# EAGLE design variable_supply_module_v3 (EAGLE 7.1.0)
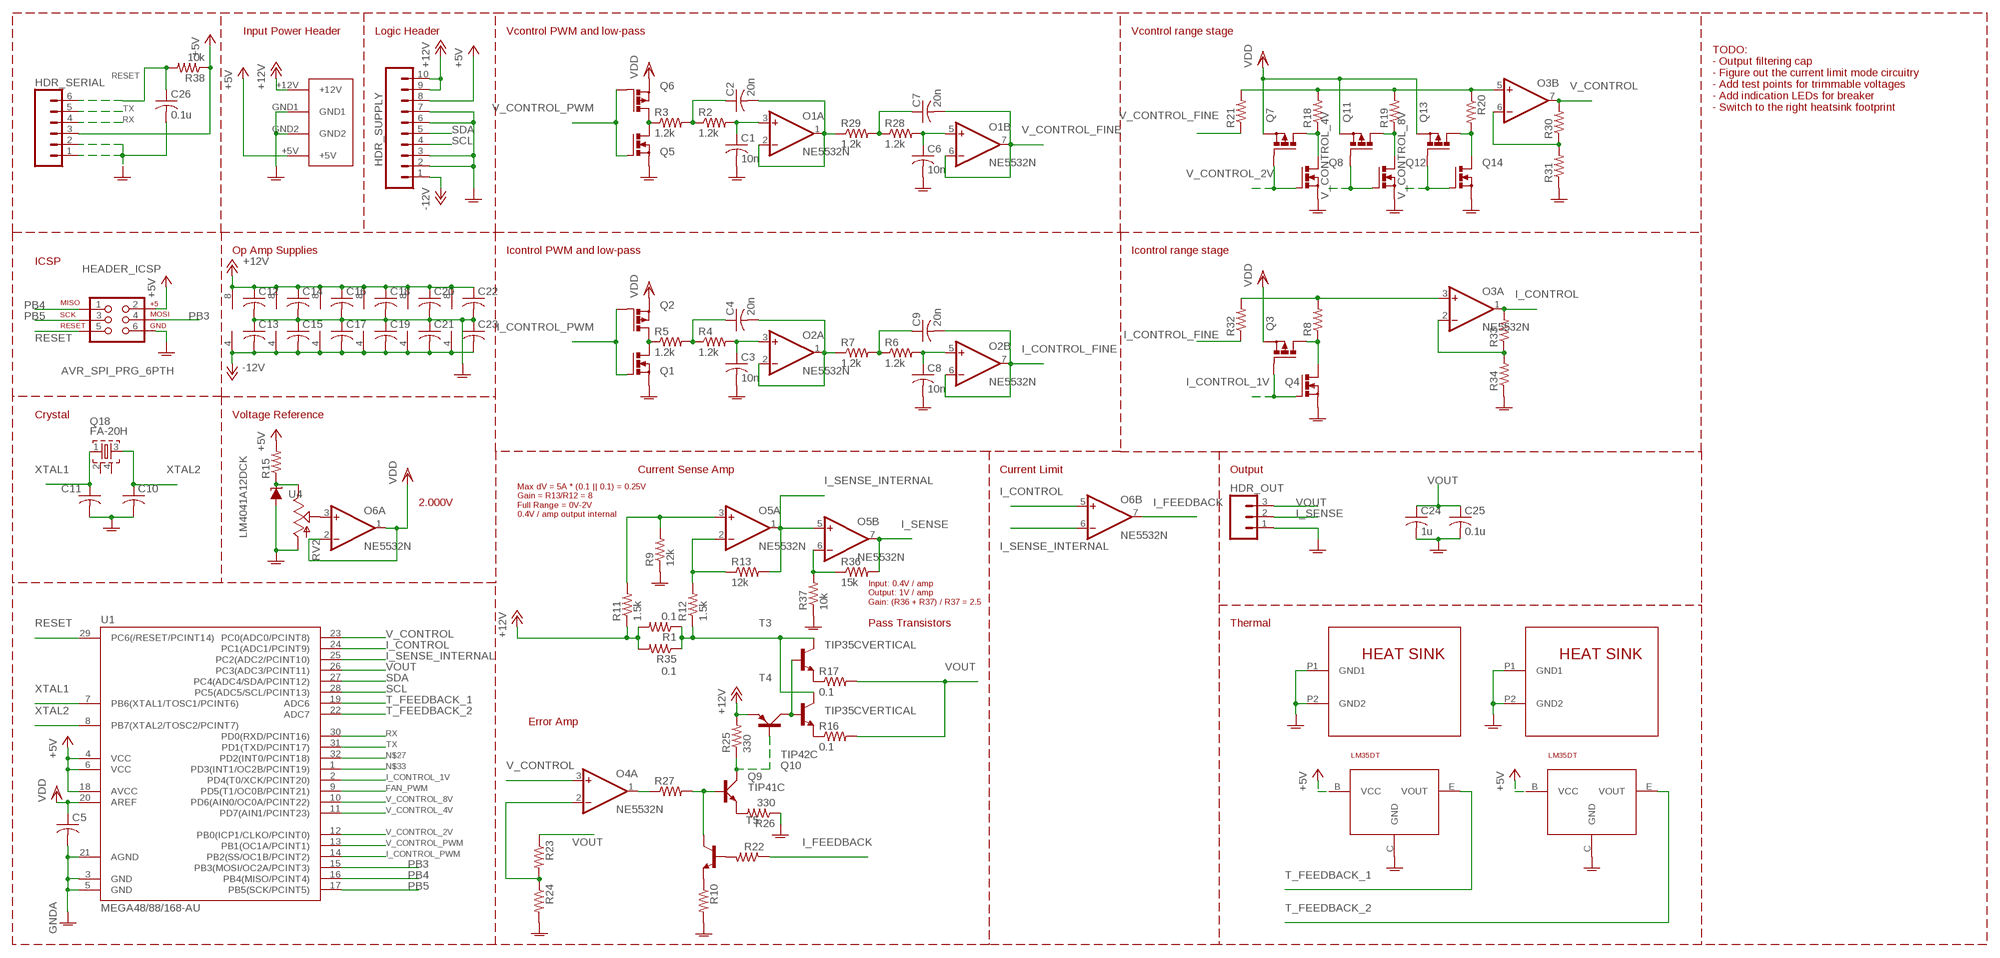
[diagram p0: schematic, sheet 1]

## Parts
C1  10n  C-USC0805  [C0805]
C2  20n  C-USC0805  [C0805]
C3  10n  C-USC0805  [C0805]
C4  20n  C-USC0805  [C0805]
C5  C-USC0805  [C0805]
C6  10n  C-USC0805  [C0805]
C7  20n  C-USC0805  [C0805]
C8  10n  C-USC0805  [C0805]
C9  20n  C-USC0805  [C0805]
C10  C-USC0805  [C0805]
C11  C-USC0805  [C0805]
C12  C-USC0805  [C0805]
C13  C-USC0805  [C0805]
C14  C-USC0805  [C0805]
C15  C-USC0805  [C0805]
C16  C-USC0805  [C0805]
C17  C-USC0805  [C0805]
C18  C-USC0805  [C0805]
C19  C-USC0805  [C0805]
C20  C-USC0805  [C0805]
C21  C-USC0805  [C0805]
C22  C-USC0805  [C0805]
C23  C-USC0805  [C0805]
C24  1u  C-USC1206  [C1206]
C25  0.1u  C-USC1206  [C1206]
C26  0.1u  C-USC0805  [C0805]
HDR_OUT  M03  [03P]
HDR_SERIAL  M06LONGPADS  [1X06_LONGPADS]
HDR_SUPPLY  M10  [10P]
HEADER_ICSP  AVR_SPI_PRG_6PTH  [2X3]
O1  NE5532N  [DIL08]
O2  NE5532N  [DIL08]
O3  NE5532N  [DIL08]
O4  NE5532N  [DIL08]
O5  NE5532N  [DIL08]
O6  NE5532N  [DIL08]
Q1  PMOSFET_NSOT23-GSD  [SOT23]
Q2  PMOSFET_PSOT-23GSD  [SOT23]
Q3  PMOSFET_PSOT-23GSD  [SOT23]
Q4  PMOSFET_NSOT23-GSD  [SOT23]
Q5  PMOSFET_NSOT23-GSD  [SOT23]
Q6  PMOSFET_PSOT-23GSD  [SOT23]
Q7  PMOSFET_PSOT-23GSD  [SOT23]
Q8  PMOSFET_NSOT23-GSD  [SOT23]
Q9  TIP41C  [TO220AV]
Q10  TIP42C  [TO220AV]
Q11  PMOSFET_PSOT-23GSD  [SOT23]
Q12  PMOSFET_NSOT23-GSD  [SOT23]
Q13  PMOSFET_PSOT-23GSD  [SOT23]
Q14  PMOSFET_NSOT23-GSD  [SOT23]
Q18  FA-20H  [FA-20H]
R1  0.1  R-US_R2010  [R2010]
R2  1.2k  R-US_M0805  [M0805]
R3  1.2k  R-US_M0805  [M0805]
R4  1.2k  R-US_M0805  [M0805]
R5  1.2k  R-US_M0805  [M0805]
R6  1.2k  R-US_M0805  [M0805]
R7  1.2k  R-US_M0805  [M0805]
R8  R-US_M0805  [M0805]
R9  12k  R-US_M0805  [M0805]
R10  R-US_M0805  [M0805]
R11  1.5k  R-US_M0805  [M0805]
R12  1.5k  R-US_M0805  [M0805]
R13  12k  R-US_M0805  [M0805]
R15  R-US_M0805  [M0805]
R16  0.1  R-US_R2010  [R2010]
R17  0.1  R-US_R2010  [R2010]
R18  R-US_M0805  [M0805]
R19  R-US_M0805  [M0805]
R20  R-US_M0805  [M0805]
R21  R-US_M0805  [M0805]
R22  R-US_M0805  [M0805]
R23  R-US_M0805  [M0805]
R24  R-US_M0805  [M0805]
R25  330  R-US_M0805  [M0805]
R26  330  R-US_M0805  [M0805]
R27  R-US_M0805  [M0805]
R28  1.2k  R-US_M0805  [M0805]
R29  1.2k  R-US_M0805  [M0805]
R30  R-US_M0805  [M0805]
R31  R-US_M0805  [M0805]
R32  R-US_M0805  [M0805]
R33  R-US_M0805  [M0805]
R34  R-US_M0805  [M0805]
R35  0.1  R-US_R2010  [R2010]
R36  15k  R-US_M0805  [M0805]
R37  10k  R-US_M0805  [M0805]
R38  10k  R-US_M0805  [M0805]
RV2  POTTRIM  [TRIM_POT]
T3  TIP35CVERTICAL  [TO247]
T4  TIP35CVERTICAL  [TO247]
T5  MMBT2222ALT1-NPN-SOT23-BEC  [SOT23-BEC]
U1  MEGA48/88/168-AU  [TQFP32-08]
U2  LM35DT  [TO220AV]
U3  LM35DT  [TO220AV]
U4  LM4041A12DCK  [DCK_R-PDSO-G5]
U$1  MOLEX-8981  [MOLEX-8981-MALE]
U$2  FA-T220-X  [FA-T220-X]
U$3  FA-T220-X  [FA-T220-X]

## Nets
+5V: HDR_SERIAL.3 HDR_SUPPLY.8 HEADER_ICSP.2 R15.2 R38.1 U1.4(VCC) U1.6(VCC) U1.18(AVCC) U2.B(VCC) U3.B(VCC) U$1.+5V
+12V: C12.1 C14.1 C16.1 C18.1 C20.1 C22.1 HDR_SUPPLY.9 HDR_SUPPLY.10 O1.8(P:V+) O2.8(P:V+) O3.8(P:V+) O4.8(P:V+) O5.8(P:V+) O6.8(P:V+) Q10.E R1.2 R11.1 R25.2 R35.2 U$1.+12V
-12V: C13.2 C15.2 C17.2 C19.2 C21.2 C23.2 HDR_SUPPLY.1 O1.4(P:V-) O2.4(P:V-) O3.4(P:V-) O4.4(P:V-) O5.4(P:V-) O6.4(P:V-)
FAN_PWM: U1.9(PD5(T1/OC0B/PCINT21))
FINE_ADJ: C2.2 O1.1(A:OUT) O1.2(A:-IN) R29.1
FINE_ADJ1: C4.2 O2.1(A:OUT) O2.2(A:-IN) R7.1
GNDA: C1.2 C3.2 C5.2 C6.2 C8.2 C10.2 C11.2 C12.2 C13.1 C14.2 C15.1 C16.2 C17.1 C18.2 C19.1 C20.2 C21.1 C22.2 C23.1 C24.2 C25.2 C26.2 HDR_OUT.1 HDR_SERIAL.1 HDR_SERIAL.2 HDR_SUPPLY.2 HDR_SUPPLY.3 HDR_SUPPLY.6 HDR_SUPPLY.7 HEADER_ICSP.6 Q1.2(S) Q4.2(S) Q5.2(S) Q8.2(S) Q12.2(S) Q14.2(S) R9.1 R10.2 R24.2 R26.1 R31.1 R34.1 R37.1 RV2.3(A) U1.3(GND) U1.5(GND) U1.21(AGND) U2.C(GND) U3.C(GND) U4.1(A) U$1.GND1 U$1.GND2 U$2.P1(GND1) U$2.P2(GND2) U$3.P1(GND1) U$3.P2(GND2)
I_CONTROL: O3.1(A:OUT) O6.5(B:+IN) R33.2 U1.24(PC1(ADC1/PCINT9))
I_CONTROL_1V: Q3.1(G) Q4.1(G) U1.2(PD4(T0/XCK/PCINT20))
I_CONTROL_FINE: C9.2 O2.6(B:-IN) O2.7(B:OUT) R32.1
I_CONTROL_PWM: Q1.1(G) Q2.1(G) U1.14(PB2(SS/OC1B/PCINT2))
I_FEEDBACK: O6.7(B:OUT) R22.1
I_SENSE: HDR_OUT.2 O5.7(B:OUT) R36.2
I_SENSE_INTERNAL: O5.1(A:OUT) O5.5(B:+IN) O6.6(B:-IN) R13.2 U1.25(PC2(ADC2/PCINT10))
N$1: C1.1 O1.3(A:+IN) R2.2
N$2: C2.1 R2.1 R3.2
N$3: C3.1 O2.3(A:+IN) R4.2
N$4: C4.1 R4.1 R5.2
N$5: Q5.3(D) Q6.3(D) R3.1
N$6: Q9.B R27.2 T5.C
N$7: Q1.3(D) Q2.3(D) R5.1
N$8: C8.1 O2.5(B:+IN) R6.2
N$9: C9.1 R6.1 R7.2
N$10: Q13.3(D) Q14.3(D) R20.2
N$11: Q11.3(D) Q12.3(D) R19.1
N$12: Q7.3(D) Q8.3(D) R18.1
N$13: O6.3(A:+IN) RV2.1(S)
N$14: O3.3(A:+IN) R8.2 R32.2
N$15: O5.3(A:+IN) R9.2 R11.2
N$16: O5.2(A:-IN) R12.2 R13.1
N$17: R10.1 T5.E
N$18: R16.1 T4.P3(E)
N$19: R17.1 T3.P3(E)
N$20: R1.1 R12.1 R35.1 T3.P2(C) T4.P2(C)
N$22: O3.2(A:-IN) R33.1 R34.2
N$23: R22.2 T5.B
N$24: O5.6(B:-IN) R36.1 R37.2
N$25: O3.5(B:+IN) R18.2 R19.2 R20.1 R21.2
N$27: U1.32(PD2(INT0/PCINT18))
N$28: C6.1 O1.5(B:+IN) R28.2
N$29: O4.2(A:-IN) R23.2 R24.1
N$30: Q9.C Q10.B R25.1
N$31: Q9.E R26.2
N$32: O4.1(A:OUT) R27.1
N$33: U1.1(PD3(INT1/OC2B/PCINT19))
N$38: R15.1 RV2.2(E) U4.3(C)
N$39: C7.1 R28.1 R29.2
N$41: Q3.3(D) Q4.3(D) R8.1
N$45: O3.6(B:-IN) R30.1 R31.2
PB3: HEADER_ICSP.4 U1.15(PB3(MOSI/OC2A/PCINT3))
PB4: HEADER_ICSP.1 U1.16(PB4(MISO/PCINT4))
PB5: HEADER_ICSP.3 U1.17(PB5(SCK/PCINT5))
RESET: C26.1 HDR_SERIAL.6 HEADER_ICSP.5 R38.2 U1.29(PC6(/RESET/PCINT14))
RX: HDR_SERIAL.4 U1.30(PD0(RXD/PCINT16))
SCL: HDR_SUPPLY.4 U1.28(PC5(ADC5/SCL/PCINT13))
SDA: HDR_SUPPLY.5 U1.27(PC4(ADC4/SDA/PCINT12))
T_FEEDBACK_1: U1.19(ADC6) U2.E(VOUT)
T_FEEDBACK_2: U1.22(ADC7) U3.E(VOUT)
TX: HDR_SERIAL.5 U1.31(PD1(TXD/PCINT17))
V_CONTROL: O3.7(B:OUT) O4.3(A:+IN) R30.2 U1.23(PC0(ADC0/PCINT8))
V_CONTROL_2V: Q7.1(G) Q8.1(G) U1.12(PB0(ICP1/CLKO/PCINT0))
V_CONTROL_4V: Q11.1(G) Q12.1(G) U1.11(PD7(AIN1/PCINT23))
V_CONTROL_8V: Q13.1(G) Q14.1(G) U1.10(PD6(AIN0/OC0A/PCINT22))
V_CONTROL_FINE: C7.2 O1.6(B:-IN) O1.7(B:OUT) R21.1
V_CONTROL_PWM: Q5.1(G) Q6.1(G) U1.13(PB1(OC1A/PCINT1))
VDD: C5.1 O6.1(A:OUT) O6.2(A:-IN) Q2.2(S) Q3.2(S) Q6.2(S) Q7.2(S) Q11.2(S) Q13.2(S) U1.20(AREF)
VOUT: C24.1 C25.1 HDR_OUT.3 R16.2 R17.2 R23.1 U1.26(PC3(ADC3/PCINT11))
VREF: Q10.C T3.P1(B) T4.P1(B)
XTAL1: C11.1 Q18.1 U1.7(PB6(XTAL1/TOSC1/PCINT6))
XTAL2: C10.1 Q18.3 U1.8(PB7(XTAL2/TOSC2/PCINT7))
Unconnected: O4.5(B:+IN) O4.6(B:-IN) O4.7(B:OUT) Q18.2 Q18.4

## Notes on the sheet
- Input Power Header | Logic Header | Vcontrol PWM and low-pass | Vcontrol range stage
- TODO:
  - Output filtering cap
  - Figure out the current limit mode circuitry
  - Add test points for trimmable voltages
  - Add indication LEDs for breaker
  - Switch to the right heatsink footprint
- Op Amp Supplies | Icontrol PWM and low-pass | Icontrol range stage
- ICSP
- Crystal | Voltage Reference
- Current Sense Amp | Current Limit | Output
- 2.000V
- Max dV = 5A * (0.1 || 0.1) = 0.25V
  Gain = R13/R12 = 8
  Full Range = 0V-2V
  0.4V / amp output internal
- Input: 0.4V / amp
  Output: 1V / amp
  Gain: (R36 + R37) / R37 = 2.5
- Pass Transistors | Thermal
- Error Amp

## Library data of the parts
C1-C26 = rcl:C-US: CAPACITOR, American symbol
HDR_OUT = con-amp-quick:M03: AMP QUICK CONNECTOR; OC_FARNELL: unknown; OC_NEWARK: unknown
HDR_SERIAL = SparkFun-Connectors:M06: Header 6 Standard 6-pin 0.1" header. Use with straight break away headers (SKU : PRT-00116), right angle break away headers (PRT-00553), swiss pins (PRT-00743), machine pins (PRT-00117), and female headers (PRT-00115). Molex polarized connector foot print use with SKU : PRT-08094 with associated crimp pins and housings. NOTES ON THE VARIANTS LOCK and LOCK_LONGPADS... This footprint was designed to help hold the alignment of a through-hole component (i.e. 6-pin header) while soldering it into place. You may notice that each hole has been shifted either up or down by 0.005 of an inch from it's more standard position (which is a perfectly straight line). This slight alteration caused the pins (the squares in the middle) to touch the edges of the holes. Because they are alternating, it causes a "brace" to hold the component in place. 0.005 has proven to be the perfect amount of "off-center" position when using our standard breakaway headers. Although looks a little odd when you look at the bare footprint, once you have a header in there, the alteration is very hard to notice. Also,if you push a header all the way into place, it is covered up entirely on the bottom side. This idea of altering the position of holes to aid alignment will be further integrated into the Sparkfun Library for other footprints. It can help hold any component with 3 or more connection pins.
HDR_SUPPLY = con-amp-quick:M10: AMP QUICK CONNECTOR; OC_FARNELL: unknown; OC_NEWARK: unknown
HEADER_ICSP = SparkFun-Connectors:AVR_SPI_PRG_6: AVR ISP 6 Pin This is the reduced ISP connector for AVR programming. Common on Arduino. This footprint will take up less PCB space and can be used with a 10-pin to 6-pin adapter such as SKU: BOB-08508
O1-O6 = linear:NE5532: AUDIO AMPLIFIER
Q1 Q4 Q5 Q8 Q12 Q14 = custom_parts:PMOSFET_N: MOSFET N-Channel
Q2 Q3 Q6 Q7 Q11 Q13 = custom_parts:PMOSFET_P: MOSFET P-Channel
Q9 = transistor-power:TIP41C: NPN TRANSISTOR
Q10 = transistor-power:TIP42C: PNP TRANSISTOR
Q18 = crystal:FA-: MHz RANGE CRYSTAL UNIT Source: Epson Toyocom
R1-R13 R15-R38 = rcl:R-US_: RESISTOR, American symbol
RV2 = SparkFun-Electromechanical:POT
T3 T4 = parts:TIP35C
T5 = transistor:*-NPN-: NPN Transistror BF959 corrected 2008.03.06
U1 = avr-7:MEGA48/88/168
U2 U3 = parts:LM35DT
U4 = texas:LM4041: PRECISION MICROPOWER SHUNT VOLTAGE REFERENCE Source: http://focus.ti.com/lit/ds/slcs146e/slcs146e.pdf; MPN: LM4041A12IDCKR; OC_FARNELL: unknown; OC_NEWARK: 58K5877
U$1 = parts:MOLEX-8981
U$2 U$3 = parts:FA-T220-X

## Board
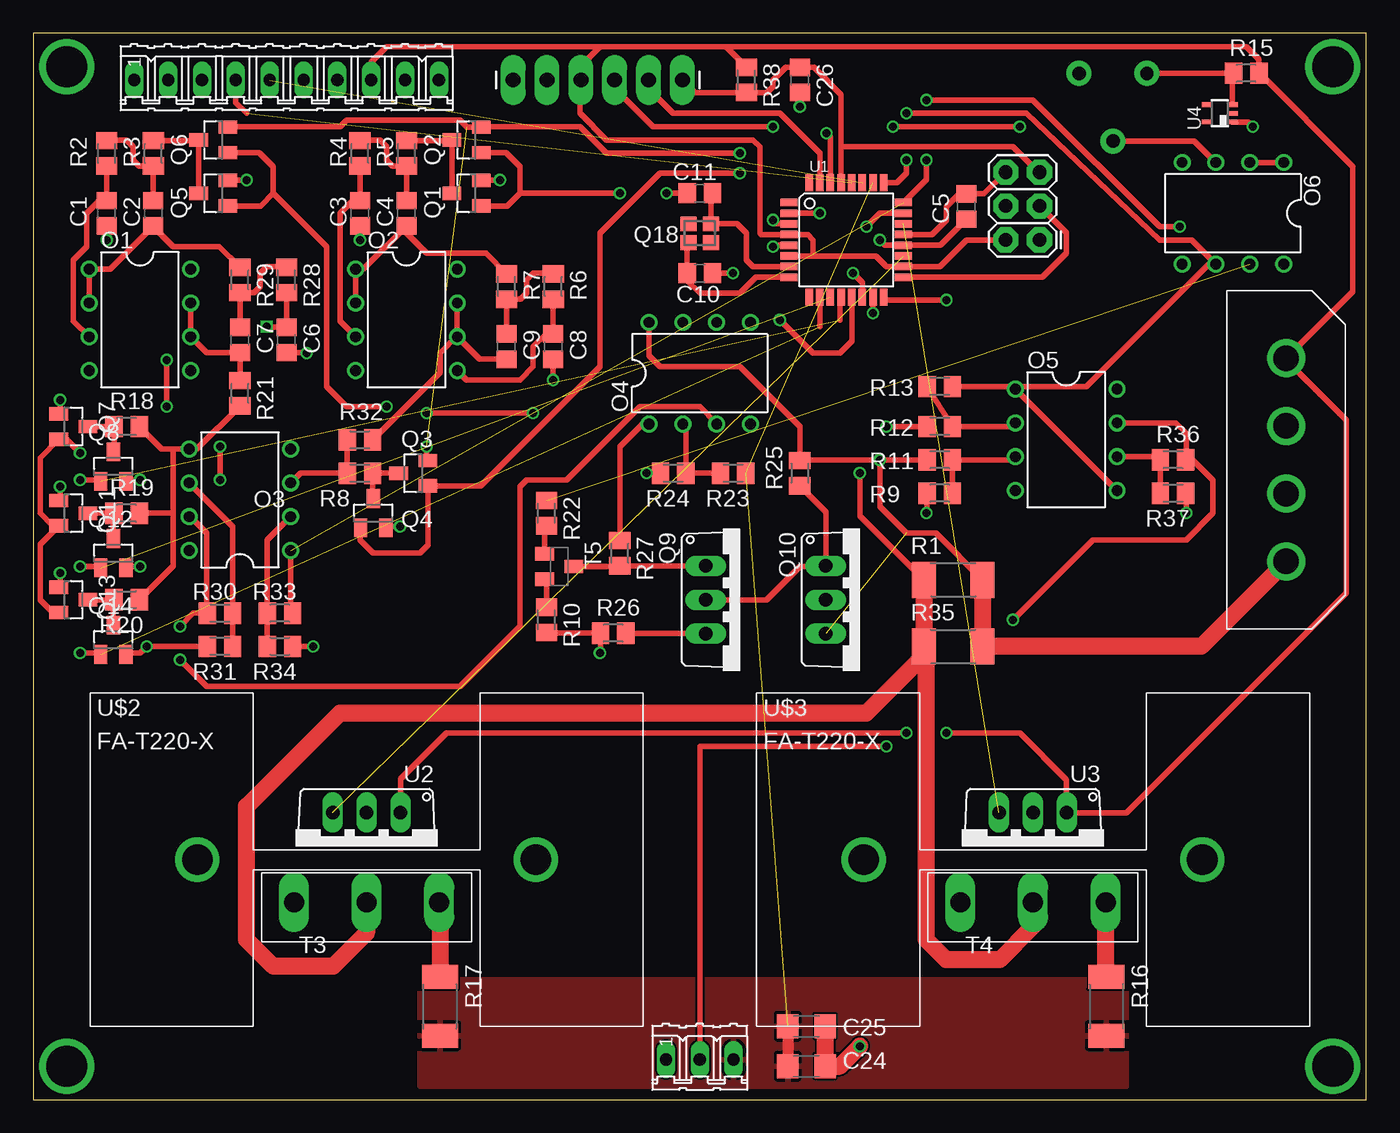
[diagram p1: board, top side]
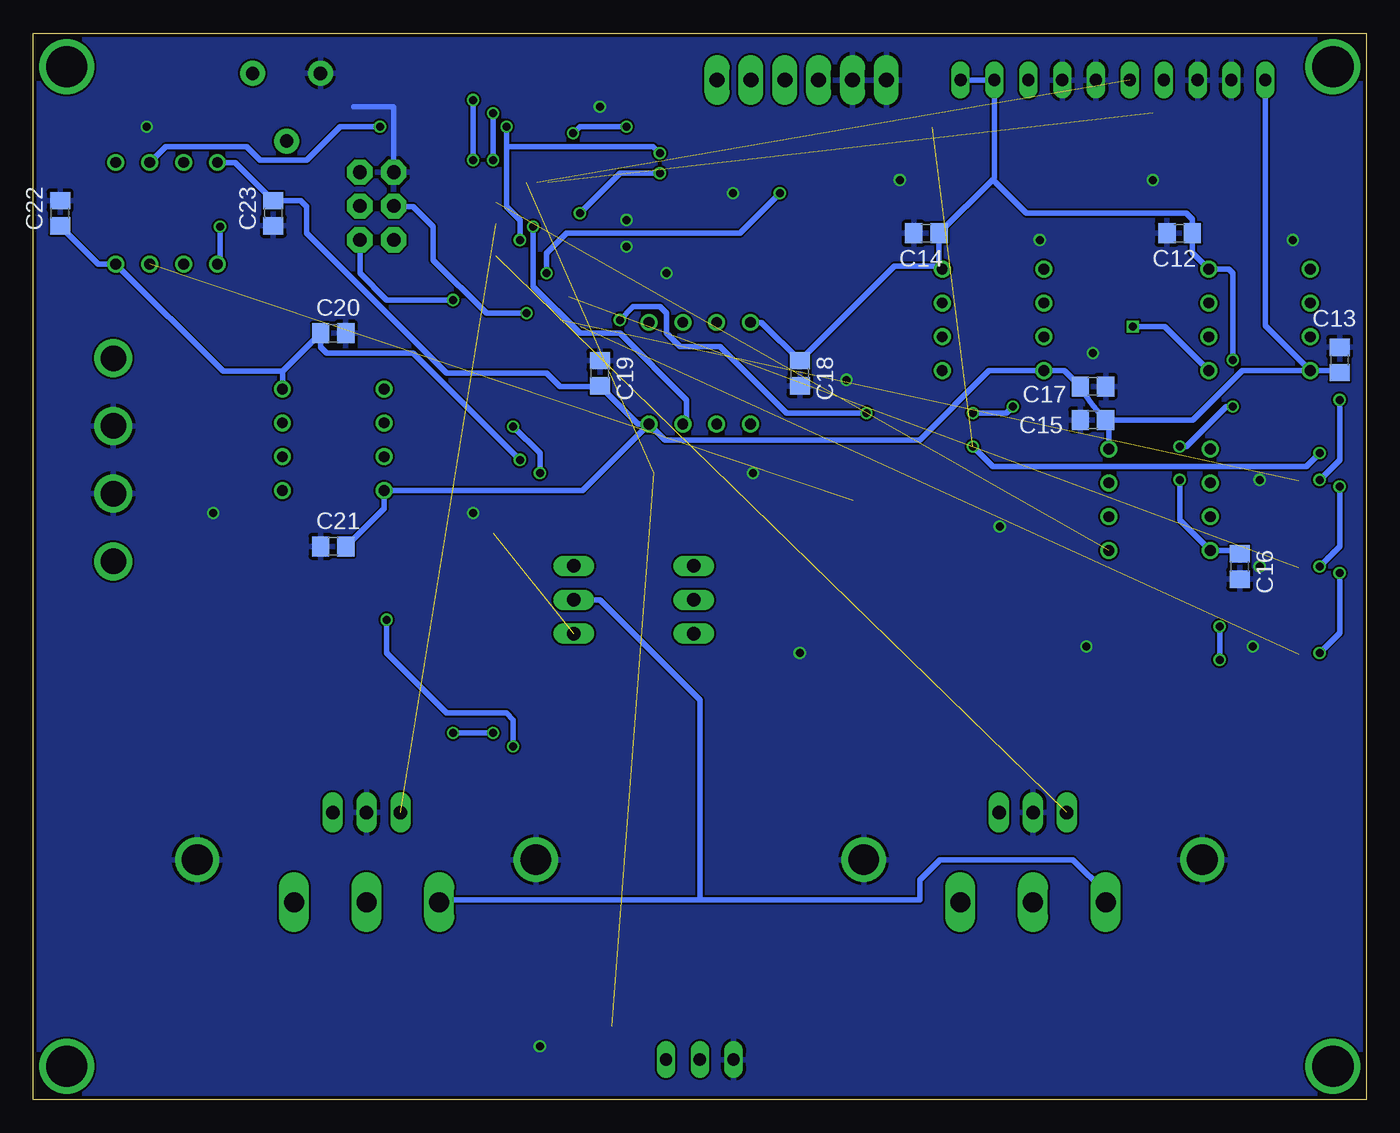
[diagram p2: board, bottom side, seen from below]

Size 100 x 80 mm. Coordinates in mm from the lower left corner, seen from the top.
Outline: 0,0 100,0 100,80 0,80 0,0
Copper layers (1*16): Top 0.035mm / dielectric 0.2mm / Bottom 0.035mm
Design rules "SeeedStudio_DRU_no_angle_20130527 *": minimum track width 6mil, minimum drill 12mil, track to track 6mil, track to pad 6mil, pad to pad 6mil, via to via 6mil, smd to smd 0mil, copper to edge 10mil, drill to drill 10mil, minimum pad ring 6mil, minimum via ring 6mil, stop-mask expansion 2mil, vias tented up to drill 25mil, thermal gap 10mil
tRestrict: area 94,74 to 101,81; area -1,74 to 6,81; area -1,-1 to 6,6; area 94,-1 to 101,6

### Footprints (pad centres in the part's own frame; a part is rotated, then mirrored left to right if it is on the bottom)
C0805 = smd 1.3 x 1.5: 1 -0.95,0; 2 0.95,0
C1206 = smd 1.6 x 1.8: 1 -1.4,0; 2 1.4,0
03P = drill 0.914 long: 1 -2.54,0; 2 0,0; 3 2.54,0
1X06_LONGPADS = drill 1.118 pad 1.88 long: 1 0,0; 2 2.54,0; 3 5.08,0; 4 7.62,0; 5 10.16,0; 6 12.7,0
10P = drill 0.914 long: 1 -11.43,0; 2 -8.89,0; 3 -6.35,0; 4 -3.81,0; 5 -1.27,0; 6 1.27,0; 7 3.81,0; 8 6.35,0; 9 8.89,0; 10 11.43,0
2X3 = drill 1.016 pad 1.88 octagon: 1 0,0; 2 0,2.54; 3 2.54,0; 4 2.54,2.54; 5 5.08,0; 6 5.08,2.54
DIL08 = drill 0.813 pad 1.27: 1 -3.81,-3.81; 2 -1.27,-3.81; 3 1.27,-3.81; 4 3.81,-3.81; 5 3.81,3.81; 6 1.27,3.81; 7 -1.27,3.81; 8 -3.81,3.81
SOT23 = smd 1 x 1.4: 1 -0.95,-1.1; 2 0.95,-1.1; 3 0,1.1
TO220AV = drill 1.016 long: B -2.54,-2.54; C 0,-2.54; E 2.54,-2.54
FA-20H = smd 1.2 x 1.1: 1 -0.85,-0.7; 2 0.85,-0.7; 3 0.85,0.7; 4 -0.85,0.7
R2010 = smd 1.8 x 2.7: 1 -2.2,0; 2 2.2,0
M0805 = smd 1.3 x 1.6: 1 -0.95,0; 2 0.95,0
TRIM_POT = drill 1 pad 1.88: 1 5.08,0; 2 0,2.54; 3 0,-2.54
TO247 = drill 1.5 long: P1 -5.45,-2.2; P2 0,-2.2; P3 5.45,-2.2
SOT23-BEC = smd 1 x 1.4: B -0.95,-1.1; C 0,1.1; E 0.95,-1.1
TQFP32-08 = smd 1.27 x 0.559: 1 -4.293,2.8; 2 -4.293,2; 3 -4.293,1.2; 4 -4.293,0.4; 5 -4.293,-0.4; 6 -4.293,-1.2; 7 -4.293,-2; 8 -4.293,-2.8; 17 4.293,-2.8; 18 4.293,-2; 19 4.293,-1.2; 20 4.293,-0.4; 21 4.293,0.4; 22 4.293,1.2; 23 4.293,2; 24 4.293,2.8 | smd 0.559 x 1.27: 9 -2.8,-4.293; 10 -2,-4.293; 11 -1.2,-4.293; 12 -0.4,-4.293; 13 0.4,-4.293; 14 1.2,-4.293; 15 2,-4.293; 16 2.8,-4.293; 25 2.8,4.293; 26 2,4.293; 27 1.2,4.293; 28 0.4,4.293; 29 -0.4,4.293; 30 -1.2,4.293; 31 -2,4.293; 32 -2.8,4.293
DCK_R-PDSO-G5 = smd 0.35 x 0.8: 1 -0.65,-0.95; 2 0,-0.95; 3 0.65,-0.95; 4 0.65,0.95; 5 -0.65,0.95
MOLEX-8981-MALE = drill 1.905: +5V 7.62,0; +12V -7.62,0; GND1 -2.54,0; GND2 2.54,0
FA-T220-X = drill 2.3: P1 -12.7,0; P2 12.7,0

### Placement (x,y rotation side)
C1  5.5,66.5 270 top
C2  9,66.5 270 top
C3  24.5,66.5 270 top
C4  28,66.5 270 top
C5  70,67 90 top
C6  19,57 270 top
C7  15.5,57 270 top
C8  39,56.5 270 top
C9  35.5,56.5 270 top
C10  50,62 0 top
C11  50,68 180 top
C12  14,65 180 bottom
C13  2,55.5 270 bottom
C14  33,65 180 bottom
C15  20.5,53.5 180 bottom
C16  9.5,40 270 bottom
C17  20.5,51 0 bottom
C18  42.5,54.5 270 bottom
C19  57.5,54.5 270 bottom
C20  77.5,57.5 0 bottom
C21  77.5,41.5 0 bottom
C22  98,66.5 90 bottom
C23  82,66.5 90 bottom
C24  58,2.5 0 top
C25  58,5.5 0 top
C26  57.5,76.5 270 top
HDR_OUT  50,3 0 top
HDR_SERIAL  36,76.5 0 top
HDR_SUPPLY  19,76.5 0 top
HEADER_ICSP  75.5,64.5 90 top
O1  8,58.5 270 top
O2  28,58.5 270 top
O3  15.5,45 90 top
O4  50,54.5 0 top
O5  77.5,49.5 270 top
O6  90,66.5 180 top
Q1  32.5,68 90 top
Q2  32.5,72 90 top
Q3  28.5,47 90 top
Q4  25.5,44 0 top
Q5  13.5,68 90 top
Q6  13.5,72 90 top
Q7  3,50.5 270 top
Q8  6,47.5 0 top
Q9  53,37.5 270 top
Q10  62,37.5 270 top
Q11  3,44 270 top
Q12  6,41 0 top
Q13  3,37.5 270 top
Q14  6,34.5 0 top
Q18  50,65 180 top
R1  69,39 0 top
R2  5.5,71 270 top
R3  9,71 270 top
R4  24.5,71 270 top
R5  28,71 270 top
R6  39,61 270 top
R7  35.5,61 270 top
R8  24.5,47 180 top
R9  68,45.5 0 top
R10  38.5,36 270 top
R11  68,48 0 top
R12  68,50.5 0 top
R13  68,53.5 0 top
R15  91,77 0 top
R16  80.5,7 270 top
R17  30.5,7 270 top
R18  7,50.5 0 top
R19  7,44 0 top
R20  7,37.5 180 top
R21  15.5,53 270 top
R22  38.5,44 270 top
R23  52.5,47 180 top
R24  48,47 180 top
R25  57.5,47 90 top
R26  43.5,35 0 top
R27  44,41 270 top
R28  19,61.5 270 top
R29  15.5,61.5 270 top
R30  14,36.5 180 top
R31  14,34 0 top
R32  24.5,49.5 180 top
R33  18.5,36.5 0 top
R34  18.5,34 180 top
R35  69,34 0 top
R36  85.5,48 0 top
R37  85.5,45.5 180 top
R38  53.5,76.5 270 top
RV2  81,77 270 top
T3  25,17 0 top
T4  75,17 0 top
T5  39.46,40 270 top
U1  61,64.5 0 top
U2  25,19 180 top
U3  75,19 180 top
U4  89,74 90 top
U$1  94,48 90 top
U$2  25,18 0 top
U$3  75,18 0 top

### Tracks (layer width: path | path; a pad name or v marks a point on that pad's centre or on a via)
+5V  (via drill 0.6)
  Top 0.406: R38.1 51.95,79 | 51.95,79 42.5,79 | 42.5,79 41.08,77.58 HDR_SERIAL.3 41,76.42 41,74 43,72 54,72 54.5,71.5 54.5,65 54.6,64.9 U1.4 58.1,64.9 58.5,64.5 58.5,63.3 | U1.6 58.5,63.3 | 58.5,63.3 63.2,63.3 64,62.5 U1.18 68,62.5 70,64.5 HEADER_ICSP.2 | HDR_SUPPLY.8 25.35,77.85 26.5,79 42.5,79 | 51.95,79 91,79 91.95,78.05 R15.2 92,77 99,70 99,60.62 U$1.+5V 94,55.5 98.5,51 98.5,38 82,21.5 77.58,21.5 U3.B 77.5,21.58 77.5,24 74,27.5 v68.5,27.5 | U2.B 27.54,24.04 31,27.5 v65.5,27.5
  Bottom 0.406: v65.5,27.5 v68.5,27.5
+12V  (via drill 0.6)  (1 unrouted)
  Top 0.406: v63.5,48 57.55,48 R25.2 57.5,50.5 53,55 47,55 46.19,55.81 O4.8 | v63.5,48 R11.1 | R35.2 71.04,33.34 | v10,55.5 v10,52 | v14,49 v14,46.5 | R1.2 67.7,42.5 65.5,42.5 63.5,44.5 v63.5,48
  Top 1.27: U$1.+12V 87.62,34 R35.2 R1.2
  Bottom 0.406: O2.8 32.05,62.55 | 32.05,62.55 C14.1 28.02,69.03 | C16.1 9.74,41.19 O3.8 14,43.5 v14,46.5 | O4.8 45.36,58.31 C18.1 35.4,62.55 32.05,62.55 | 81.31,54.64 C20.1 78.45,56.45 78,56 71.5,56 v63.5,48 | 81.31,54.64 O5.8 | C22.1 95.14,62.69 O6.8 85.76,54.64 81.31,54.64 | 28.02,69.03 27.89,69.16 HDR_SUPPLY.9 HDR_SUPPLY.10 | 28.02,69.03 25.5,66.5 13.5,66.5 13.05,66.05 C12.1 13.05,63.55 O1.8 10.31,62.31 10,62 v10,55.5 | v10,52 10.5,52 13.5,49 v14,49
-12V
  Bottom 0.406: C13.2 2.14,54.69 O1.4 | C17.2 19.31,50.76 O3.4 | O4.4 54.64,50.69 C19.2 57.55,53.5 60.5,53.5 61.5,54.5 69,54.5 79.5,65 79.5,67 79.95,67.45 C23.2 84.86,70.31 O6.4 | C21.2 73.69,44.36 O5.4 58.81,45.69 O4.4 | C17.2 arc16 C15.2 22.64,54.69 O2.4 28.31,54.69 33.5,49.5 52.62,49.5 O4.4 | HDR_SUPPLY.1 7.57,58.07 O1.4 | O1.4 9.31,54.69 13,51 C17.2
FINE_ADJ
  Top 0.406: R29.1 13.95,64 10.5,64 9,65.5 C2.2 5.76,62.31 O1.1 O1.2
FINE_ADJ1
  Top 0.406: R7.1 33.95,63.5 29.5,63.5 28,65 C4.2 24.76,62.31 O2.1 O2.2
GNDA  (via drill 0.6)
  Top 0.406: C10.2 v52.5,62 | C11.2 v47.5,68 | U1.21 67.4,64.9 68.5,66 68.5,67 69.5,68 69.95,68 C5.2 71.33,67.95 HEADER_ICSP.6 | U1.5 55.6,64.1 v55.5,64 | U1.3 55.7,65.7 v55.5,66 | C26.2 v57.5,74.5 | Q1.2 33.65,69 v35,69 | Q5.2 14.65,69 v16,69 | C1.2 5.55,65.5 5.55,64.55 v5.5,64.5 | Q8.2 7.05,46.5 v8,46.5 | Q12.2 7.05,40 v8,40 | Q14.2 7.05,33.5 8,33.5 v8.5,34 R31.1 | R34.1 v21,34 | Q4.2 26.55,43 v27.5,43 | R10.2 38.55,35 R26.1 42.55,33.55 v42.5,33.5 | R37.1 86.5,45.45 v86.5,44 | R24.2 v46,47 | R9.1 67.05,44.05 v67,44 | C3.2 v24.5,64.5 | C6.2 20.45,56.05 v20.5,56 | U4.1 91.15,73.35 v91.5,73 | C8.2 v39,54
  Top 1.27: C25.2 C24.2 60.5,2.5 v62,4
  Bottom 0.406: 75.96,74.5 73,74.5 72.96,74.46 HEADER_ICSP.6
  pour Bottom: 0,80 100,80 100,0 0,0
I_CONTROL  (via drill 0.6)  (1 unrouted)
  Top 0.406: O3.1 19.31,36.64 R33.2 | U1.24 67,69.01 v67,70.5 | v86,65.5 84.5,65.5 75,75 v67,75
  Bottom 0.406: v67,70.5 v67,75 | O6.5 86,62.88 v86,65.5
I_CONTROL_1V  (via drill 0.6)
  Top 0.406: Q4.1 24.5,42.85 24.5,42 25.5,41 29,41 29.6,41.6 Q3.1 33.55,46.05 42.5,55 42.5,65 47,69.5 v53,69.5 | v59,66.5 U1.2
  Bottom 0.406: v53,69.5 56,69.5 v59,66.5
I_CONTROL_FINE
  Top 0.406: O2.6 33.49,55.55 C9.2 | O2.6 O2.7 | R32.1 30.5,54.55 30.5,56 31.73,57.23 O2.6
I_CONTROL_PWM  (via drill 0.6)
  Top 0.406: Q1.1 35.55,67.05 36.5,68 | 36.5,68 36.5,70 35.45,71.05 Q2.1 | 36.5,68 v44,68 | v61.5,62 62.2,61.3 U1.14
  Bottom 0.406: v44,68 47,65 60,65 61.5,63.5 v61.5,62
I_FEEDBACK  (1 unrouted)
I_SENSE  (via drill 0.6)
  Top 0.406: O5.7 85.73,50.77 86.5,50 86.5,48.05 R36.2 87,48 88.5,46.5 88.5,44 86.5,42 79.5,42 v73.5,36 | HDR_OUT.2 50,26.5 v64,26.5
  Bottom 0.406: v64,26.5 64,28.5 64.5,29 69,29 73.5,33.5 v73.5,36
I_SENSE_INTERNAL  (via drill 0.6)
  Top 0.406: R13.2 73.5,53.5 O5.1 | O5.1 O5.5 | O5.1 73.88,53.5 79,53.5 88.19,62.69 O6.6 86.92,64.5 84.5,64.5 74.5,74 v65.5,74 | U1.25 64.79,68.79 65.5,69.5 v65.5,70.5
  Bottom 0.406: v65.5,70.5 v65.5,74
N$1
  Top 0.406: R2.2 C1.1 4.95,67.45 4,66.5 4,64 3,63 3,58.42 O1.3
N$2
  Top 0.406: C2.1 R3.2 7.95,70.05 7.5,70.5 7.5,71.5 7,72 5.55,72 R2.1
N$3
  Top 0.406: R4.2 C3.1 23.95,67.45 23,66.5 23,58.42 O2.3
N$4
  Top 0.406: C4.1 R5.2 26.95,70.05 26.5,70.5 26.5,71.5 26,72 24.55,72 R4.1
N$5
  Top 0.406: Q5.3 Q6.3 12.35,71.95 R3.1
N$6
  Top 0.406: Q9.B R27.2 43.95,40 T5.C
N$7
  Top 0.406: Q1.3 Q2.3 31.35,71.95 R5.1
N$8
  Top 0.406: R6.2 C8.1 38.45,57.45 37.5,56.5 37.5,55 36.5,54 32.5,54 O2.5
N$9
  Top 0.406: C9.1 R7.2 36.55,60.05 37,60.5 37,61.5 37.5,62 38.95,62 R6.1
N$10
  Top 0.406: Q14.3 6,37.45 R20.2 Q13.3
N$11
  Top 0.406: Q11.3 R19.1 6,43.95 Q12.3
N$12
  Top 0.406: Q7.3 R18.1 6.05,48.65 Q8.3
N$13
  Top 0.406: RV2.1 87.12,71.92 O6.3
N$14
  Top 0.406: R32.2 R8.2 20.04,47 O3.3
N$15
  Top 0.406: O5.3 73.46,48 R11.2 R9.2
N$16
  Top 0.406: O5.2 73.42,50.5 R12.2 R13.1
N$17
  Top 0.406: T5.E 38.5,38.91 R10.1
N$18
  Top 1.27: R16.1 80.45,9.25 T4.P3
N$19
  Top 1.27: T3.P3 30.5,14.75 R17.1
N$20  (via drill 0.6)
  Top 0.406: R1.1 62,43.8 v62,47 | v64,50.5 R12.1
  Top 1.27: R1.1 R35.1 67,33.8 67,33.5 | 67,33.5 67,12 68.5,10.5 72.5,10.5 75,13 T4.P2 | 67,33.5 62.5,29 23,29 16,22 16,12 18,10 22.5,10 25,12.5 T3.P2
  Bottom 0.406: v62,47 62,48.5 v64,50.5
N$22
  Top 0.406: O3.2 17.55,41.97 R33.1 R34.2
N$23
  Top 0.406: R22.2 38.36,42.91 T5.B
N$24
  Top 0.406: R37.2 R36.1 84.32,48.23 O5.6
N$25
  Top 0.406: R21.2 12.26,48.81 O3.5 10.5,48.81 | R18.2 9.64,48.81 10.5,48.81 | R20.1 10.5,40.05 10.5,44 | 10.5,44 10.5,48.81 | R19.2 10.5,44
N$26  (via drill 3.1 pad 3.81)
  other vias: 2.5,2.5
N$28  (via drill 0.6)
  Top 0.406: R28.2 C6.1 17.55,57.95 v17.5,58
  Bottom 0.406: O1.5 15.12,58 v17.5,58
N$29
  Top 0.406: O4.2 48.95,50.47 R24.1 R23.2
N$30
  Top 0.406: R25.1 59.46,44.09 Q10.B 59.42,40 57.5,40 55,37.5 Q9.C
N$31
  Top 0.406: R26.2 44.49,34.96 Q9.E
N$32
  Top 0.406: R27.1 44,49 45.69,50.69 O4.1
N$34  (via drill 3.1 pad 3.81)
  other vias: 97.5,2.5
N$36  (via drill 3.1 pad 3.81)
  other vias: 97.5,77.5
N$37  (via drill 3.1 pad 3.81)
  other vias: 2.5,77.5
N$38
  Top 0.406: U4.3 89.95,76.9 R15.1 RV2.2
N$39
  Top 0.406: C7.1 R29.2 16.55,60.55 17,61 17,62 17.5,62.5 18.95,62.5 R28.1
N$41
  Top 0.406: Q3.3 R8.1 25.45,45.15 Q4.3
N$45
  Top 0.406: O3.6 14.95,43.01 R30.1 R31.2
PB3  (via drill 0.6)
  Top 0.406: U1.15 v63,59
  Bottom 0.406: v63,59 66,59 70,63 70,65.5 71.5,67 72.92,67 HEADER_ICSP.4
PB4  (via drill 0.6)
  Top 0.406: v68.5,60 64.01,60 U1.16
  Bottom 0.406: HEADER_ICSP.1 75.5,62 73.5,60 v68.5,60
PB5
  Top 0.406: U1.17 75.7,61.7 77.5,63.5 77.5,65.04 HEADER_ICSP.3
RESET
  Top 0.406: HDR_SERIAL.6 49.65,75.55 R38.2 55.05,75.55 55.5,76 55.5,76.5 56.45,77.45 C26.1 58.55,77.45 60.6,75.4 60.6,71.5 | 60.6,71.5 U1.29 | HEADER_ICSP.5 75.42,69.58 73.5,71.5 60.6,71.5
RX  (via drill 0.6)
  Top 0.406: HDR_SERIAL.4 43.62,75.88 46.5,73 v55.5,73 | v59.5,72.5 59.8,72.2 U1.30
  Bottom 0.406: v55.5,73 59,73 v59.5,72.5
SCL  (1 unrouted)
  Top 0.406: HDR_SUPPLY.4 15.19,74.81 16,74
SDA  (1 unrouted)
T_FEEDBACK_1  (1 unrouted)
T_FEEDBACK_2  (1 unrouted)
TX
  Top 0.406: HDR_SERIAL.5 46.16,75.84 48,74 56,74 59,71 U1.31
V_CONTROL  (via drill 0.6)
  Top 0.406: O3.7 11.77,43.73 13,42.5 13,36.55 R30.2 12,36.5 v11,35.5 | O4.3 51.27,50.73 50,52 45.5,52 40,46.5 37,46.5 36.5,46 36.5,35.5 32,31 13,31 v11,33 | U1.23 63.5,66.5 v62.5,65.5
  Bottom 0.406: v11,33 v11,35.5 | v62.5,65.5 62.5,61 59,57.5 56,57.5 51,52.5 51,50.96 O4.3
V_CONTROL_2V  (via drill 0.6)  (1 unrouted)
  Top 0.406: Q7.1 2,51.55 v2,52.5 | v3.5,46.5 4.95,46.5 Q8.1 | U1.12 60.5,60.11 60.5,58.5
  Bottom 0.406: v2,52.5 2,48 v3.5,46.5
V_CONTROL_4V  (via drill 0.6)  (1 unrouted)
  Top 0.406: Q11.1 2,45.05 v2,46 | v3.5,40 4.95,40 Q12.1
  Bottom 0.406: v2,46 2,41.5 v3.5,40
V_CONTROL_8V  (via drill 0.6)  (1 unrouted)
  Top 0.406: Q13.1 2,38.55 v2,39.5 | v3.5,33.5 4.95,33.5 Q14.1 | U1.10 59,58
  Bottom 0.406: v2,39.5 2,35 v3.5,33.5
V_CONTROL_FINE
  Top 0.406: R21.1 C7.2 12.99,56.05 O1.6 O1.7
V_CONTROL_PWM  (via drill 0.6)
  Top 0.406: Q5.1 17.05,67.05 18,68 | 18,68 18,70 16.95,71.05 Q6.1 | 61.5,60.11 U1.13 61.4,56.9 60.5,56 58.5,56 v56,58.5 | 18,68 22,64 22,53.5 23.5,52 v26.5,52 | v29.5,51.5 v37.5,51.5
  Bottom 0.406: v26.5,52 27,51.5 v29.5,51.5 | v37.5,51.5 43.5,51.5 48.5,56.5 51.5,56.5 52.5,57.5 52.5,59 53,59.5 55,59.5 v56,58.5
VDD  (via drill 0.6)  (1 unrouted)
  Top 0.406: O6.2 O6.1 | C5.1 68.05,64.1 U1.20 63.9,64.1 v63.5,64.5 | Q6.2 14.65,73 23,73 23.5,73.5 32,73.5 32.55,72.95 Q2.2 33.65,73 41,73 43,71 v53,71 | Q13.2 1.45,36.55 0.5,37.5 0.5,41.65 Q11.2 1.45,43.05 0.5,44 0.5,48.15 Q7.2 2.45,49.55 v3.5,48.5 | Q3.2 29.5,48.05 v29.5,49 | v74,73 v64.5,73
  Bottom 0.406: O6.2 90.08,71.5 84,71.5 83,70.5 79.5,70.5 77,73 v74,73 | v63.5,64.5 63.5,66 64.5,67 64.5,71.5 | v53,71 53.5,71.5 64.5,71.5 | v29.5,49 28,47.5 4.5,47.5 v3.5,48.5 | v64.5,73 64.5,71.5
VOUT  (2 unrouted)
  Top 0.813: C25.1 C24.1
  pour Top: 29,9 82,9 82,1 29,1
VREF
  Bottom 0.406: Q10.C 57.5,37.5 50,30 50,15 | 50,15 69.35,15 T4.P1 | 50,15 33.5,15 33.5,16.5 32,18 22,18 19.55,15.55 T3.P1
XTAL1
  Top 0.406: C11.1 50.85,67.9 Q18.1 52.8,65.7 53.5,65 53.5,63 54,62.5 U1.7
XTAL2
  Top 0.406: Q18.3 49.05,64.2 C10.1 49.05,61.45 50,60.5 53,60.5 54.2,61.7 U1.8